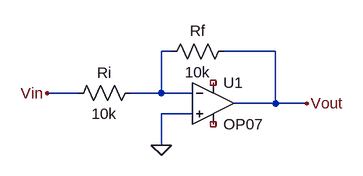
[diagram p0: schematic Op-amp_dc_gain.asc]
Op-amp_dc_gain.asc, the LTspice schematic file:
Version 4
SHEET 1 880 680
WIRE 256 80 240 80
WIRE 416 80 336 80
WIRE 112 144 64 144
WIRE 240 144 240 80
WIRE 240 144 192 144
WIRE 288 144 240 144
WIRE 416 160 416 80
WIRE 416 160 352 160
WIRE 464 160 416 160
WIRE 288 176 240 176
WIRE 240 224 240 176
FLAG 240 224 0
FLAG 64 144 Vin
FLAG 464 160 Vout
SYMBOL res 208 128 R90
WINDOW 0 0 56 VBottom 2
WINDOW 3 32 56 VTop 2
SYMATTR InstName Ri
SYMATTR Value 10k
SYMBOL OpAmps\\OP07 320 96 R0
SYMATTR InstName U1
SYMBOL res 352 64 R90
WINDOW 0 0 56 VBottom 2
WINDOW 3 32 56 VTop 2
SYMATTR InstName Rf
SYMATTR Value 10k

The netlist it stands for:
* Op-amp_dc_gain.asc
Ri N001 Vin 10k
XU1 0 N001 NC_01 NC_02 Vout LT1001  ; OP07, pins In+ In- V+ V- OUT
Rf Vout N001 10k
.lib LTC.lib
.backanno
.end